# Altium schematic sheet USB_USBC.SchDoc: USBC
size A3; Author: Silvio Navaretti; CompanyName: ARDUINO; DrawnBy: Silvio Navaretti; Engineer: Silvio Navaretti; Organization: ARDUINO; SheetNumber: 31; SheetTotal: 51; RevAuthor: Silvio Navaretti
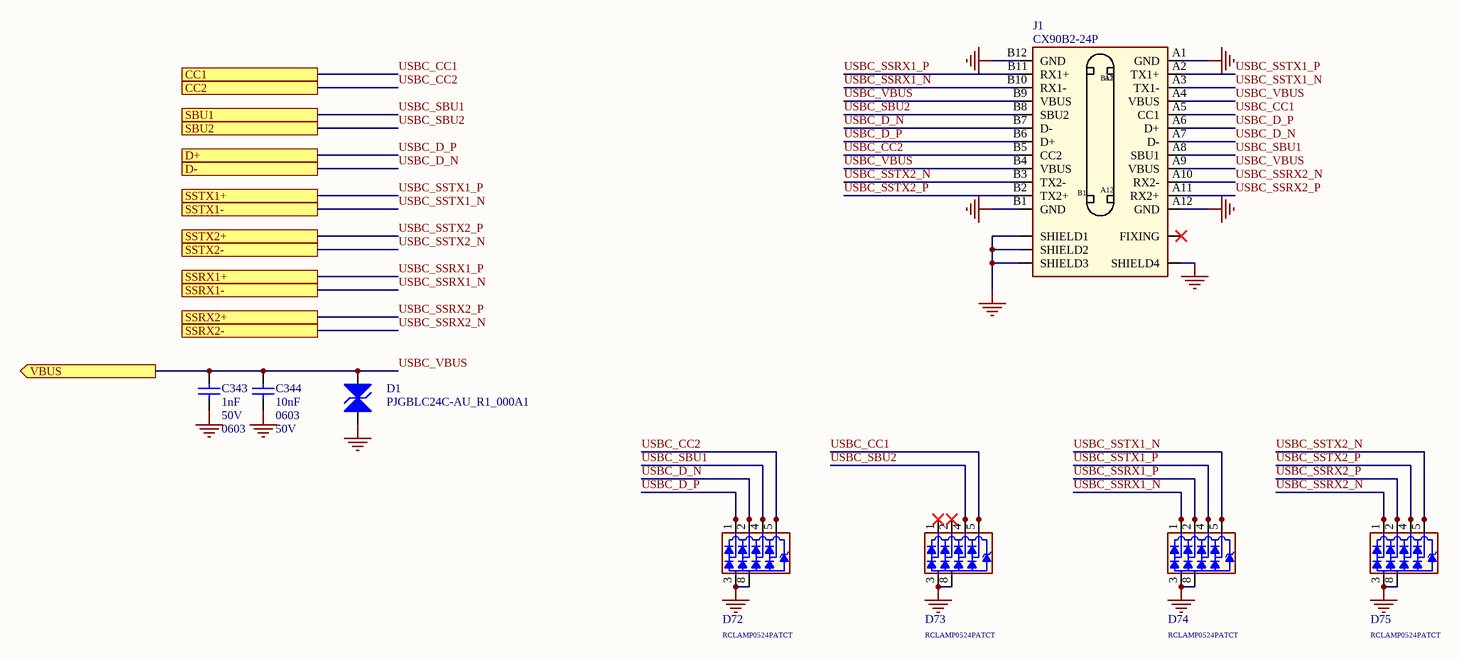
[diagram p0: USB_USBC.SchDoc]

## Parts
C343  value 1nF  Voltage: 50V  Case Code (Imperial): 0603  [CAP-0603]  (hidden comment: CL10B102KB8WPNC)
C344  value 10nF  Case Code (Imperial): 0603  Voltage: 50V  [CAP-0603]  (hidden comment: 0603B103K500CT)
D1  PJGBLC24C-AU_R1_000A1  [SOD323 NO POLARITY]
D72  RCLAMP0524PATCT  [SLP2510P8]
D73  RCLAMP0524PATCT  [SLP2510P8]
D74  RCLAMP0524PATCT  [SLP2510P8]
D75  RCLAMP0524PATCT  [SLP2510P8]
J1  CX90B2-24P  [CX90B2-24P]

## Ports
CC1, CC2, D+, D-, SBU1, SBU2, SSRX1+, SSRX1-, SSRX2+, SSRX2-, SSTX1+, SSTX1-, SSTX2+, SSTX2-, VBUS (out)

## Nets
GND: C343.2 C344.2 D1.1(A1) D72.3 D72.8 D73.3 D73.8 D74.3 D74.8 D75.3 D75.8 J1.A1(GND) J1.A12(GND) J1.B1(GND) J1.B12(GND) J1.SHIELD1 J1.SHIELD2 J1.SHIELD3 J1.SHIELD4
USBC_CC1: D73.5 D73.6 J1.A5(CC1) ; port CC1
USBC_CC2: D72.5 D72.6 J1.B5(CC2) ; port CC2
USBC_D_N: D72.2 D72.9 J1.A7(D-) J1.B7(D-) ; port D-
USBC_D_P: D72.1 D72.10 J1.A6(D+) J1.B6(D+) ; port D+
USBC_SBU1: D72.4 D72.7 J1.A8(SBU1) ; port SBU1
USBC_SBU2: D73.4 D73.7 J1.B8(SBU2) ; port SBU2
USBC_SSRX1_N: D74.1 D74.10 J1.B10(RX1-) ; port SSRX1-
USBC_SSRX1_P: D74.2 D74.9 J1.B11(RX1+) ; port SSRX1+
USBC_SSRX2_N: D75.1 D75.10 J1.A10(RX2-) ; port SSRX2-
USBC_SSRX2_P: D75.2 D75.9 J1.A11(RX2+) ; port SSRX2+
USBC_SSTX1_N: D74.5 D74.6 J1.A3(TX1-) ; port SSTX1-
USBC_SSTX1_P: D74.4 D74.7 J1.A2(TX1+) ; port SSTX1+
USBC_SSTX2_N: D75.5 D75.6 J1.B3(TX2-) ; port SSTX2-
USBC_SSTX2_P: D75.4 D75.7 J1.B2(TX2+) ; port SSTX2+
USBC_VBUS: C343.1 C344.1 D1.2(A2) J1.A4(VBUS) J1.A9(VBUS) J1.B4(VBUS) J1.B9(VBUS) ; port VBUS
NetD73_1: D73.1 D73.10
NetD73_2: D73.2 D73.9

Not connected (* = marked no-connect by the designer): J1 FIXING*

## Notes on the sheet
- Title:
- ID:
- Date:
- Time:
- Version:
- Sheet
- of
- RevAuthor:
- Reference Designs ARE PROVIDED "AS IS" AND "WITH ALL FAULTS. Arduino SA DISCLAIMS ALL OTHER WARRANTIES, EXPRESS OR IMPLIED, REGARDING PRODUCTS, INCLUDING BUT NOT LIMITED TO, ANY IMPLIED WARRANTIES OF MERCHANTABILITY OR FITNESS FOR A PARTICULAR PURPOSE.
  Arduino SA may make changes to specifications and product descriptions at any time, without notice. The Customer must not rely on the absence or characteristics of any features or instructions marked "reserved" or "undefined".
  Arduino SA reserves these for future definition and shall have no responsibility whatsoever for conflicts or incompatibilities arising from future changes to them. The product information on the Web Site or Materials is subject to change without notice.
  Do not finalize a design with this info. ARDUINO and other Arduino brands and logos and Trademarks of Arduino SA. All Arduino SA Trademarks cannot be used without owner's formal permission.
- File:
- Author:

## Library data of the parts
C343 = C0063-A.3: CAP CHIP 0603 1nF 10% 50V X7R; Manufacturer: Samsung Electro-Mechanics; Code Arduino: C0063; Tolerance: 10%; Part Number: CL10B102KB8WPNC; Dielectric: X7R
C344 = C0040-A.14: CAP CHIP 0603 10nF 10% 50V X7R; Manufacturer: Walsin; Code Arduino: 0142; Technology: Ceramic; Part number 3: CL10B103KC8NNNC; Part Number: 0603B103K500CT; Dielectric: X7R; Manufacturer 2: Hottech; Part number 2: C1608B103K500NT; Tolerance: 10%
D1 = D0098-A.2: TVS BIDIRECTIONAL SMD Vr 24V, Vbr min 27.27V, 350W, SOD-323; V(BR) Typ (V): 26.7; Code Arduino: D0098; Part Number: PJGBLC24C-AU_R1_000A1
D72-D75 = D0097-A.6: TVS UNIDIRECTIONAL 4CH 0.8pF 5V SLP2510P8 10-pin 2.5x1.0x0.58mm; Manufacturer: SEMTECH; Code Arduino: D0097; Device Type: ESD protection; Part Number: RCLAMP0524PATCT
J1 = J0010-A.12: CONN RCPT USB3.1 TYPEC 24POS SMD; Manufacturer: Hirose; Code Arduino: A5518; Gender: Receptacle; Connector Type: USB; Part Number: CX90B2-24P